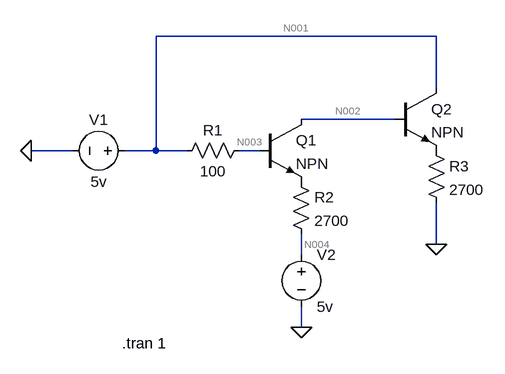
[diagram p0: schematic Draft4.asc]
Draft4.asc, the LTspice schematic file:
Version 4
SHEET 1 880 680
WIRE 384 -48 -48 -48
WIRE 384 32 384 -48
WIRE 320 80 176 80
WIRE -176 128 -240 128
WIRE -48 128 -48 -48
WIRE -48 128 -96 128
WIRE 0 128 -48 128
WIRE 112 128 80 128
WIRE 384 272 384 208
WIRE 176 288 176 256
WIRE 176 400 176 368
FLAG -240 128 0
FLAG 176 400 0
FLAG 384 272 0
SYMBOL npn 112 80 R0
SYMATTR InstName Q1
SYMBOL res 96 112 R90
WINDOW 0 0 56 VBottom 2
WINDOW 3 32 56 VTop 2
SYMATTR InstName R1
SYMATTR Value 100
SYMBOL voltage -80 128 R90
WINDOW 0 -32 56 VBottom 2
WINDOW 3 32 56 VTop 2
WINDOW 123 0 0 Left 0
WINDOW 39 0 0 Left 0
SYMATTR InstName V1
SYMATTR Value 5v
SYMBOL voltage 176 272 R0
WINDOW 123 0 0 Left 0
WINDOW 39 0 0 Left 0
SYMATTR InstName V2
SYMATTR Value 5v
SYMBOL res 160 160 R0
SYMATTR InstName R2
SYMATTR Value 2700
SYMBOL npn 320 32 R0
SYMATTR InstName Q2
SYMBOL res 368 112 R0
SYMATTR InstName R3
SYMATTR Value 2700
TEXT -100 424 Left 2 !.tran 1

The netlist it stands for:
* Draft4.asc
Q1 N002 N003 P001 0 NPN
R1 N003 N001 100
V1 N001 0 5v
V2 N004 0 5v
R2 P001 N004 2700
Q2 N001 N002 P002 0 NPN
R3 P002 0 2700
.model NPN NPN
.model PNP PNP
.lib standard.bjt
.tran 1
.backanno
.end

* Results of the author's LTspice run, read from the files saved beside the schematic
* Operating Point, zero values left out:
*   V(n002) = 4.355 V
*   V(n003) = 4.999 V
*   V(p001) = 4.982 V
*   V(n001) = 5 V
*   V(n004) = 5 V
*   V(p002) = 3.574 V
*   Ic(Q1) = -13.11 µA
*   Ib(Q1) = 6.553 µA
*   Ie(Q1) = 6.553 µA
*   Ic(Q2) = 1.311 mA
*   Ib(Q2) = 13.11 µA
*   Ie(Q2) = -1.324 mA
*   I(R1) = -6.553 µA
*   I(R2) = -6.553 µA
*   I(R3) = 1.324 mA
*   I(V1) = -1.317 mA
*   I(V2) = -6.553 µA